# EAGLE design Truss-Power (EAGLE 9.2.2)
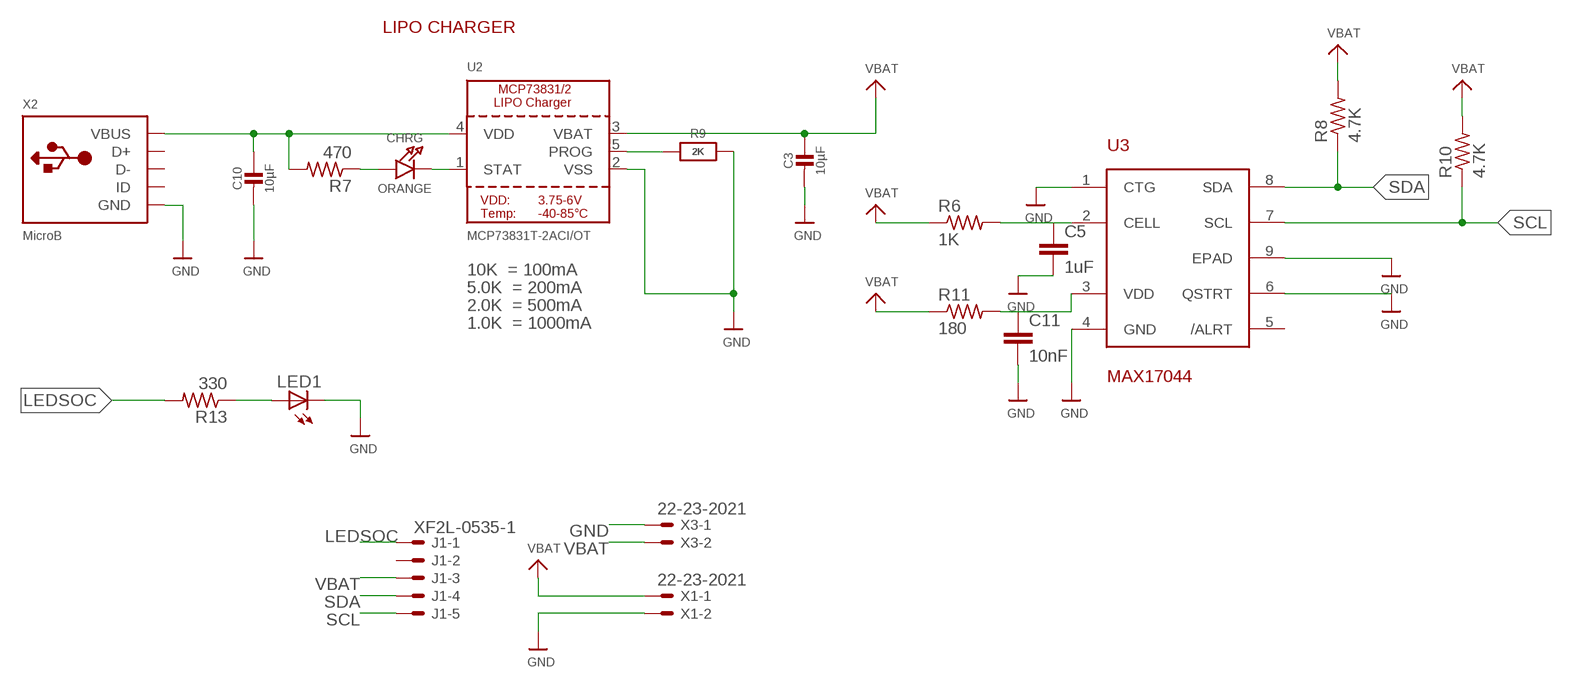
[diagram p0: schematic, sheet 1]

## Parts
C3  10µF  CAP_CERAMIC0805-NOOUTLINE  [0805-NO]
C5  1uF  C-EUC0603  [C0603]
C10  10µF  CAP_CERAMIC0805-NOOUTLINE  [0805-NO]
C11  10nF  C-EUC0603  [C0603]
CHRG  ORANGE  LED0805_NOOUTLINE  [CHIPLED_0805_NOOUTLINE]
J1  XF2L-0535-1  [XF2L-0535-1]
LED1  LEDCHIP-LED0603  [CHIP-LED0603]
R6  1K  R-US_R0402  [R0402]
R7  470  R-US_R0402  [R0402]
R8  4.7K  R-US_R0402  [R0402]
R9  2K  RESISTOR0805_NOOUTLINE  [0805-NO]
R10  4.7K  R-US_R0402  [R0402]
R11  180  R-US_R0402  [R0402]
R13  330  R-US_R0402  [R0402]
U2  MCP73831T-2ACI/OT  MCP73831/2  [SOT23-5]
U3  MAX17044  [TDFN]
X1  22-23-2021  [22-23-2021]
X2  MicroB  USBMICRO_20329  [4UCONN_20329]
X3  22-23-2021  [22-23-2021]

## Nets
GND: C3.2 C5.2 C10.2 C11.2 LED1.C R9.2 U2.2(VSS) U3.1(CTG) U3.4(GND) U3.6(QSTRT) U3.9(EPAD) X1.2 X2.BASE@1(GND) X2.BASE@2(GND) X2.GND X2.SPRT@1(GND) X2.SPRT@2(GND) X2.SPRT@3(GND) X2.SPRT@4(GND) X3.1
LEDSOC: J1.1 R13.2
N$1: C5.1 R6.2 U3.2(CELL)
N$3: C11.1 R11.2 U3.3(VDD)
N$4: LED1.A R13.1
N$5: CHRG.A R7.1
N$6: CHRG.C U2.1(STAT)
N$14: R9.1 U2.5(PROG)
SCL: J1.5 R10.1 U3.7(SCL)
SDA: J1.4 R8.1 U3.8(SDA)
VBAT: C3.1 J1.3 R6.1 R8.2 R10.2 R11.1 U2.3(VBAT) X1.1 X3.2
VBUS: C10.1 R7.2 U2.4(VDD) X2.VBUS
Unconnected: J1.2 U3.5(/ALRT) X2.D+ X2.D- X2.ID

## Notes on the sheet
- LIPO CHARGER
- 10K  = 100mA
- 5.0K  = 200mA
- 2.0K  = 500mA
- 1.0K  = 1000mA

## Library data of the parts
C3 C10 = microbuilder:CAP_CERAMIC: Ceramic Capacitors For new designs, use the packages preceded by an '_' character since they are more reliable: The following footprints should be used on most boards: _0402 - Standard footprint for regular board layouts _0603 - Standard footprint for regular board layouts _0805 - Standard footprint for regular board layouts _1206 - Standard footprint for regular board layouts For extremely tight-pitch boards where space is at a premium, the following 'micro-pitch' footprints can be used (smaller pads, no silkscreen outline, etc.): _0402MP - Micro-pitch footprint for very dense/compact boards _0603MP - Micro-pitch footprint for very dense/compact boards _0805MP - Micro-pitch footprint for very dense/compact boards _1206MP - Micro-pitch footprint for very dense/compact boards
C5 C11 = rcl:C-EU: CAPACITOR, European symbol
CHRG = microbuilder:LED: LED
J1 = con-omron:XF2*-05?: OMRON FPC Connector Source : http://www.omron.com/ecb/products/pdf/fpc.pdf; MPN: XF2L-0535-1A; OC_FARNELL: unknown; OC_NEWARK: 37M0863
LED1 = led:LED: LED
R6-R8 R10 R11 R13 = resistor:R-US_: RESISTOR, American symbol
R9 = microbuilder:RESISTOR: Resistors For new designs, use the packages preceded by an '_' character since they are more reliable: The following footprints should be used on most boards: _0402 - Standard footprint for regular board layouts _0603 - Standard footprint for regular board layouts _0805 - Standard footprint for regular board layouts _1206 - Standard footprint for regular board layouts For extremely tight-pitch boards where space is at a premium, the following 'micro-pitch' footprints can be used (smaller pads, no silkscreen outline, etc.): _0402MP - Micro-pitch footprint for very dense/compact boards _0603MP - Micro-pitch footprint for very dense/compact boards _0805MP - Micro-pitch footprint for very dense/compact boards _1206MP - Micro-pitch footprint for very dense/compact boards
U2 = microbuilder:MCP73831/2: MCP73831/2 LIPO Charger VDD: 3.75 - 6V Temp -40 - 85°C Programmable Charge Rate: 15-500mA NOTE: STAT is a tri-state logic output on the MCP73831 and an open-drain output on the MCP73832. SOT23-5 with 4.2V output and tri-state logic on STAT = MCP73831T-2ACI/OT
U3 = NewPart:MAX17044
X1 X3 = con-molex:22-23-2021: .100" (2.54mm) Center Header - 2 Pin; MF: MOLEX; MPN: 22-23-2021; OC_FARNELL: 1462926; OC_NEWARK: 25C3832
X2 = microbuilder:USB: USB Connectors USBMINIB - Surface Mount Female Mini-B USB Connector 4UConnector: 06564

## Board
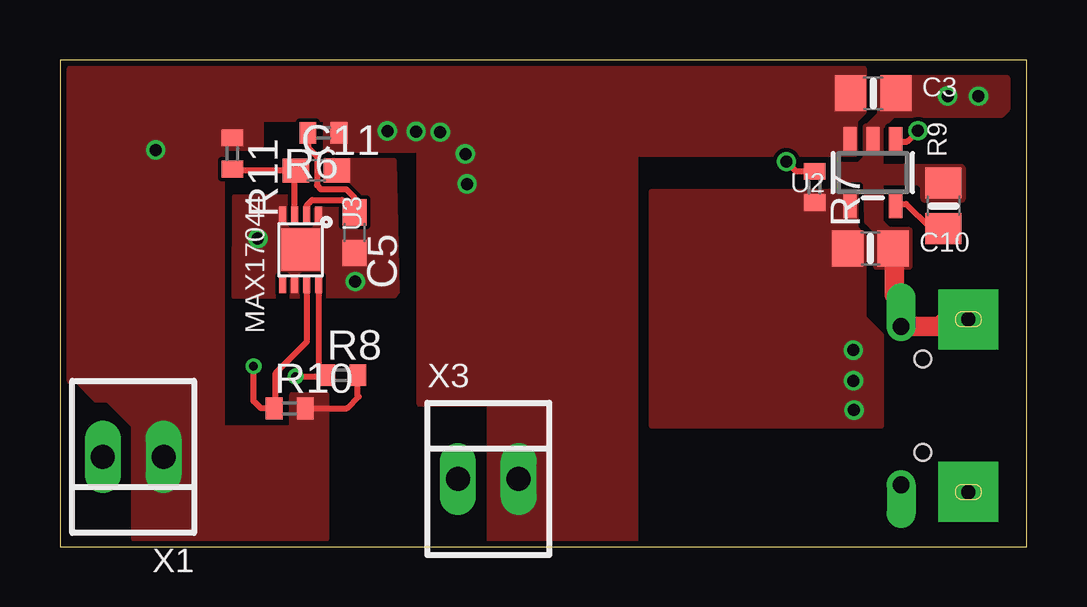
[diagram p1: board, top side]
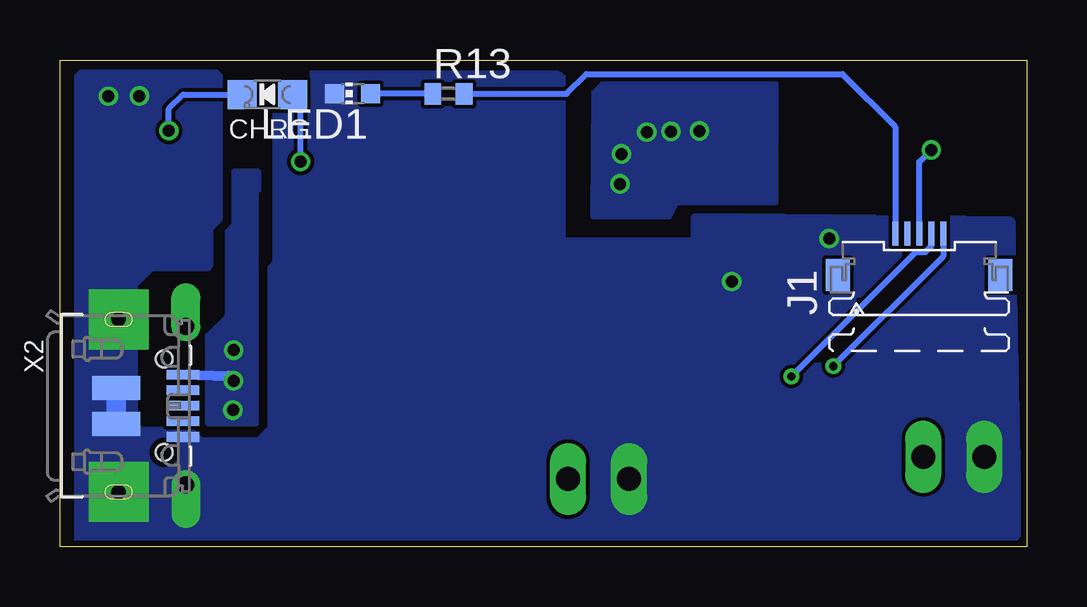
[diagram p2: board, bottom side, seen from below]

Size 40.31 x 20.31 mm. Coordinates in mm from the lower left corner, seen from the top.
Outline: 0,0 40.31,0 40.31,20.31 0,20.31 0,0
Copper layers (1*16): Top 0.035mm / dielectric 1.5mm / Bottom 0.035mm
Design rules "SeeedStudio_2layer_DRU_no_angle_20140221": minimum track width 6mil, minimum drill 12mil, track to track 6mil, track to pad 6mil, pad to pad 6mil, via to via 6mil, smd to smd 0mil, copper to edge 10mil, drill to drill 10mil, minimum pad ring 10mil, minimum via ring 6mil, stop-mask expansion 2mil, vias tented up to drill 100mil, thermal gap 10mil

### Footprints (pad centres in the part's own frame; a part is rotated, then mirrored left to right if it is on the bottom)
0805-NO = smd 1.3 x 1.5: 1 -0.95,0; 2 0.95,0
C0603 = smd 1.1 x 1: 1 -0.85,0; 2 0.85,0
CHIPLED_0805_NOOUTLINE = smd 1.2 x 1.2: A 0,-1.05; C 0,1.05
XF2L-0535-1 = smd 1 x 0.25: 1 1.905,1; 2 1.905,0.5; 3 1.905,0; 4 1.905,-0.5; 5 1.905,-1 | smd 1.34 x 1: M1 0.18,3.388; M2 0.18,-3.388
CHIP-LED0603 = smd 0.8 x 0.8: A 0,-0.75; C 0,0.75
R0402 = smd 0.7 x 0.9: 1 -0.65,0; 2 0.65,0
SOT23-5 = smd 0.55 x 1.2: 1 -0.95,-1.3; 2 0,-1.3; 3 0.95,-1.3; 4 0.95,1.3; 5 -0.95,1.3
TDFN = smd 0.3 x 0.7: 1 -0.75,-1.45; 2 -0.25,-1.45; 3 0.25,-1.45; 4 0.75,-1.45; 5 0.75,1.45; 6 0.25,1.45; 7 -0.25,1.45; 8 -0.75,1.45 | smd 1.63 x 1.75: 9 0,0
22-23-2021 = drill 1 long: 1 -1.27,0; 2 1.27,0
4UCONN_20329 = smd 1 x 2: BASE@1 -0.75,-2; BASE@2 0.75,-2 | smd 0.4 x 1.35: D+ 0,0.775; D- -0.65,0.775; GND 1.3,0.775; ID 0.65,0.775; VBUS -1.3,0.775 | drill 0.7 offset: SPRT@1 -3.3,0.9; SPRT@2 3.3,0.9 | drill 0.6 pad 2.5 square: SPRT@3 -3.6,-1.9; SPRT@4 3.6,-1.9 | hole 0.7: -1.95,0; 1.95,0

### Placement (x,y rotation side)
C3  33.9,18.92 0 top
C5  12.27,13.11 270 top
C10  33.78,12.45 0 top
C11  10.69,15.7 0 top
CHRG  31.66,18.87 90 bottom
J1  4.49,11.16 90 bottom
LED1  28.11,18.91 90 bottom
R6  10.99,17.27 180 top
R7  31.45,15.01 270 top
R8  11.77,7.16 0 top
R9  36.83,14.22 90 top
R10  9.58,5.78 0 top
R11  7.19,16.41 270 top
R13  24.12,18.9 0 bottom
U2  33.88,15.61 180 top
U3  10.03,12.4 180 top
X1  3.05,3.76 180 top
X2  35.97,5.89 270 bottom
X3  17.85,2.83 0 top

### Tracks (layer width: path | path; a pad name or v marks a point on that pad's centre or on a via)
GND  (via drill 0.5)
  Top 0.813: C10.2 34.79,12.39 34.79,10.51 35.07,10.23 X2.SPRT@1 36.66,9.19 36.95,9.49 X2.SPRT@3
  Bottom 0.813: X2.BASE@1 X2.BASE@2
  other vias: 37,18.81 38.29,18.8 12.31,11.07 8.25,12.86
  pour Top (no thermals): 34.29,19.57 39.46,19.57 39.48,19.55 39.48,18.25 39.24,18.01 34.71,18.01 34.19,17.49 34.19,15.9 34.23,15.86 37.58,15.86 37.63,15.81 37.63,14.51 37.59,14.47 36.04,14.47 35.99,14.52 35.99,15 35.8,15.19 34.21,15.19 34.19,15.17 34.19,13.58 34.54,13.23 35.38,13.23 35.41,13.2 35.41,11.71 35.37,11.67 34.05,11.67 34.04,11.68 34.04,13.16 33.65,13.55 33.61,15.16 33.44,15.33 32.26,15.33 32.26,15.91 32.29,15.94 33.33,15.94 33.62,16.23 33.65,16.23 33.59,16.29 33.59,17.51 33.61,17.53 33.67,17.53 34.19,18.05 34.19,19.47
  pour Bottom (no thermals): 13.82,13.72 13.83,12.69 19.27,12.69 19.42,12.84 19.42,19.53 19.54,19.65 31.13,19.65 31.25,19.53 31.25,11.81 31.47,11.59 31.47,4.92 32.02,4.37 34.45,4.37 34.88,4.8 37.25,4.8 37.25,10.97 36.51,11.71 34.17,11.71 34.12,11.76 34.12,13.33 33.71,13.74 33.71,19.6 33.81,19.7 39.42,19.7 39.52,19.6 39.52,0.29 39.37,0.14 0.75,0.19 0.4,0.59 0.68,13.57
  pour Top (no thermals): 7.3,14.6 9.92,14.6 10.58,14.6 10.89,14.6 10.87,16.13 12.02,16.11 12.58,16.13 13.91,16.1 14.04,10.69 14.06,10.69 13.93,10.49 7.27,10.45
LEDSOC
  Bottom 0.254: R13.2 19.19,18.9 18.37,19.72 7.69,19.72 5.49,17.52 J1.1
N$1
  Top 0.254: R6.2 10.34,16.65 10.71,16.27 10.71,15.08 10.87,14.92 11.93,14.92 12.27,14.58 C5.1 11.76,14.47 10.52,14.47 10.28,14.24 U3.2
N$3
  Top 0.254: R11.2 7.25,15.7 C11.1 9.78,15.64 U3.3
N$4
  Bottom 0.254: R13.1 LED1.A
N$5  (via drill 0.5)
  Top 0.254: R7.1 30.69,15.66 v30.28,16.07
  Bottom 0.254: v30.28,16.07 30.28,18.53 CHRG.A
N$6  (via drill 0.5)
  Top 0.254: U2.1 35.32,16.91 v35.77,17.36
  Bottom 0.254: v35.77,17.36 35.77,18.27 35.17,18.87 CHRG.C
N$14
  Top 0.254: U2.5 35.27,14.31 36.26,13.32 36.78,13.32 R9.1
SCL  (via drill 0.35)
  Top 0.254: U3.7 10.28,8.55 8.99,7.26 8.99,5.84 R10.1 8.38,5.78 8.07,6.09 v8.07,7.54
  Bottom 0.254: J1.5 3.49,12.12 v8.07,7.54
SDA  (via drill 0.35)
  Top 0.254: U3.8 10.78,7.5 R8.1 11.06,7.11 v9.82,7.11
  Bottom 0.254: J1.4 3.99,12.55 4.25,12.29 4.64,12.29 v9.82,7.11
VBAT  (via drill 0.5)
  Top 0.254: R8.2 12.41,6.3 12.45,6.27 11.96,5.78 R10.2 10.23,5.53
  Bottom 0.254: J1.3 4.49,16.06 v3.99,16.56
  other vias: 13.65,17.35 14.84,17.33 15.85,17.3 16.97,15.14 16.9,16.39
  pour Bottom (no thermals): 10.46,19.28 17.7,19.28 18.05,18.93 18.1,13.81 18.01,13.79 14.91,13.79 14.62,14.36 14.59,14.39 12.39,14.38 10.48,14.39
  pour Top (no thermals): 9.68,6.35 11.1,6.35 11.1,0.35 3.09,0.35 3.09,5.05 2,6.14 1.49,6.14 0.71,6.92 0.41,6.92 0.41,19.95 33.51,19.95 33.51,18.15 33.13,17.77 33.13,16.38 23.96,16.38 23.96,0.25 17.92,0.25 17.92,5.96 14.99,5.96 14.99,16.56 11.09,16.56 11.09,17.85 8.36,17.85 8.36,16.64 6.73,16.64 6.73,4.97 9.68,4.97
VBUS  (via drill 0.5)
  Bottom 0.406: X2.VBUS 33.29,7.14 v33.08,6.93
  other vias: 33.07,8.21 33.1,5.71
  pour Bottom (no thermals): 32.03,15.64 33.05,15.64 33.05,13.42 33.33,13.14 33.33,9.62 34.15,8.8 34.15,5.17 32.13,5.17 32.13,14.89 32.03,14.89
  pour Top (no thermals): 34.23,5.05 24.67,5.05 24.67,14.82 33.16,14.82 33.16,13.29 33.49,12.96 33.49,9.57 34.22,8.84 34.22,5.06